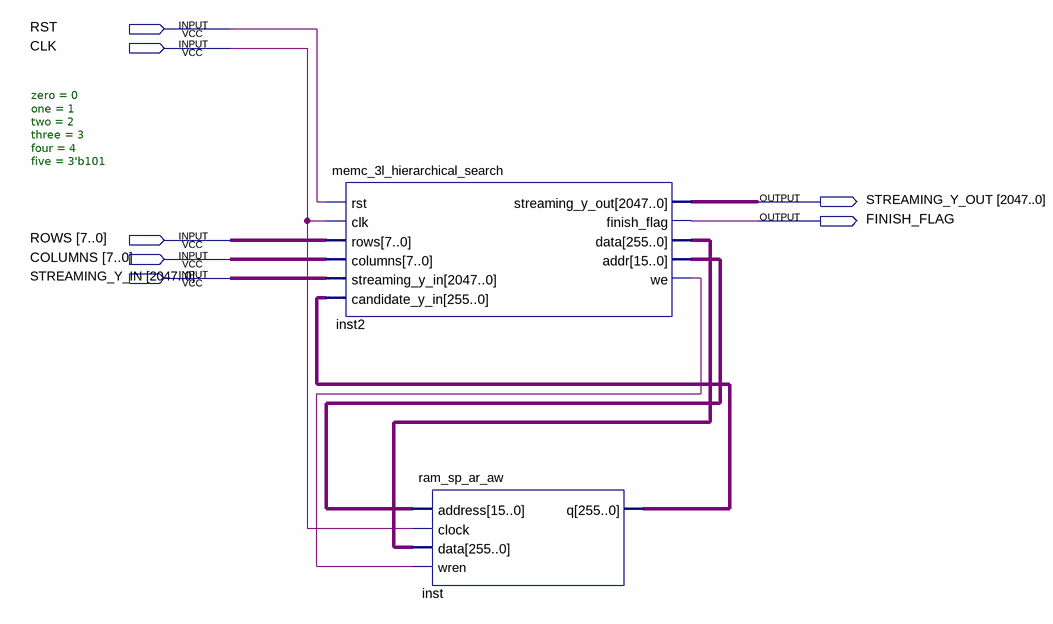
[diagram p0: schematic sheet]
// Quartus schematic ICIP2020_inter_prediction_MEMC_top.bdf as structural Verilog: 2 symbols, 7 pins
module ICIP2020_inter_prediction_MEMC_top (
  input  RST,
  input  CLK,
  input  [7:0] ROWS,
  input  [7:0] COLUMNS,
  input  [2047:0] STREAMING_Y_IN,
  output [2047:0] STREAMING_Y_OUT,
  output FINISH_FLAG
);

  wire inst2_we;
  wire [15:0] inst2_addr;
  wire [255:0] inst2_data, inst_q;

  memc_3l_hierarchical_search #(.zero(0), .one(1), .two(2), .three(3), .four(4), .five(3'b101)) inst2 (
    .rst(RST), .clk(CLK), .rows(ROWS), .columns(COLUMNS), .streaming_y_in(STREAMING_Y_IN),
    .candidate_y_in(inst_q), .streaming_y_out(STREAMING_Y_OUT), .finish_flag(FINISH_FLAG), .data(inst2_data),
    .addr(inst2_addr), .we(inst2_we));
  ram_sp_ar_aw inst (.address(inst2_addr), .clock(CLK), .data(inst2_data), .wren(inst2_we), .q(inst_q));
endmodule
